# EAGLE design Frank-Synced-BLDC-ESC (EAGLE 6.2)
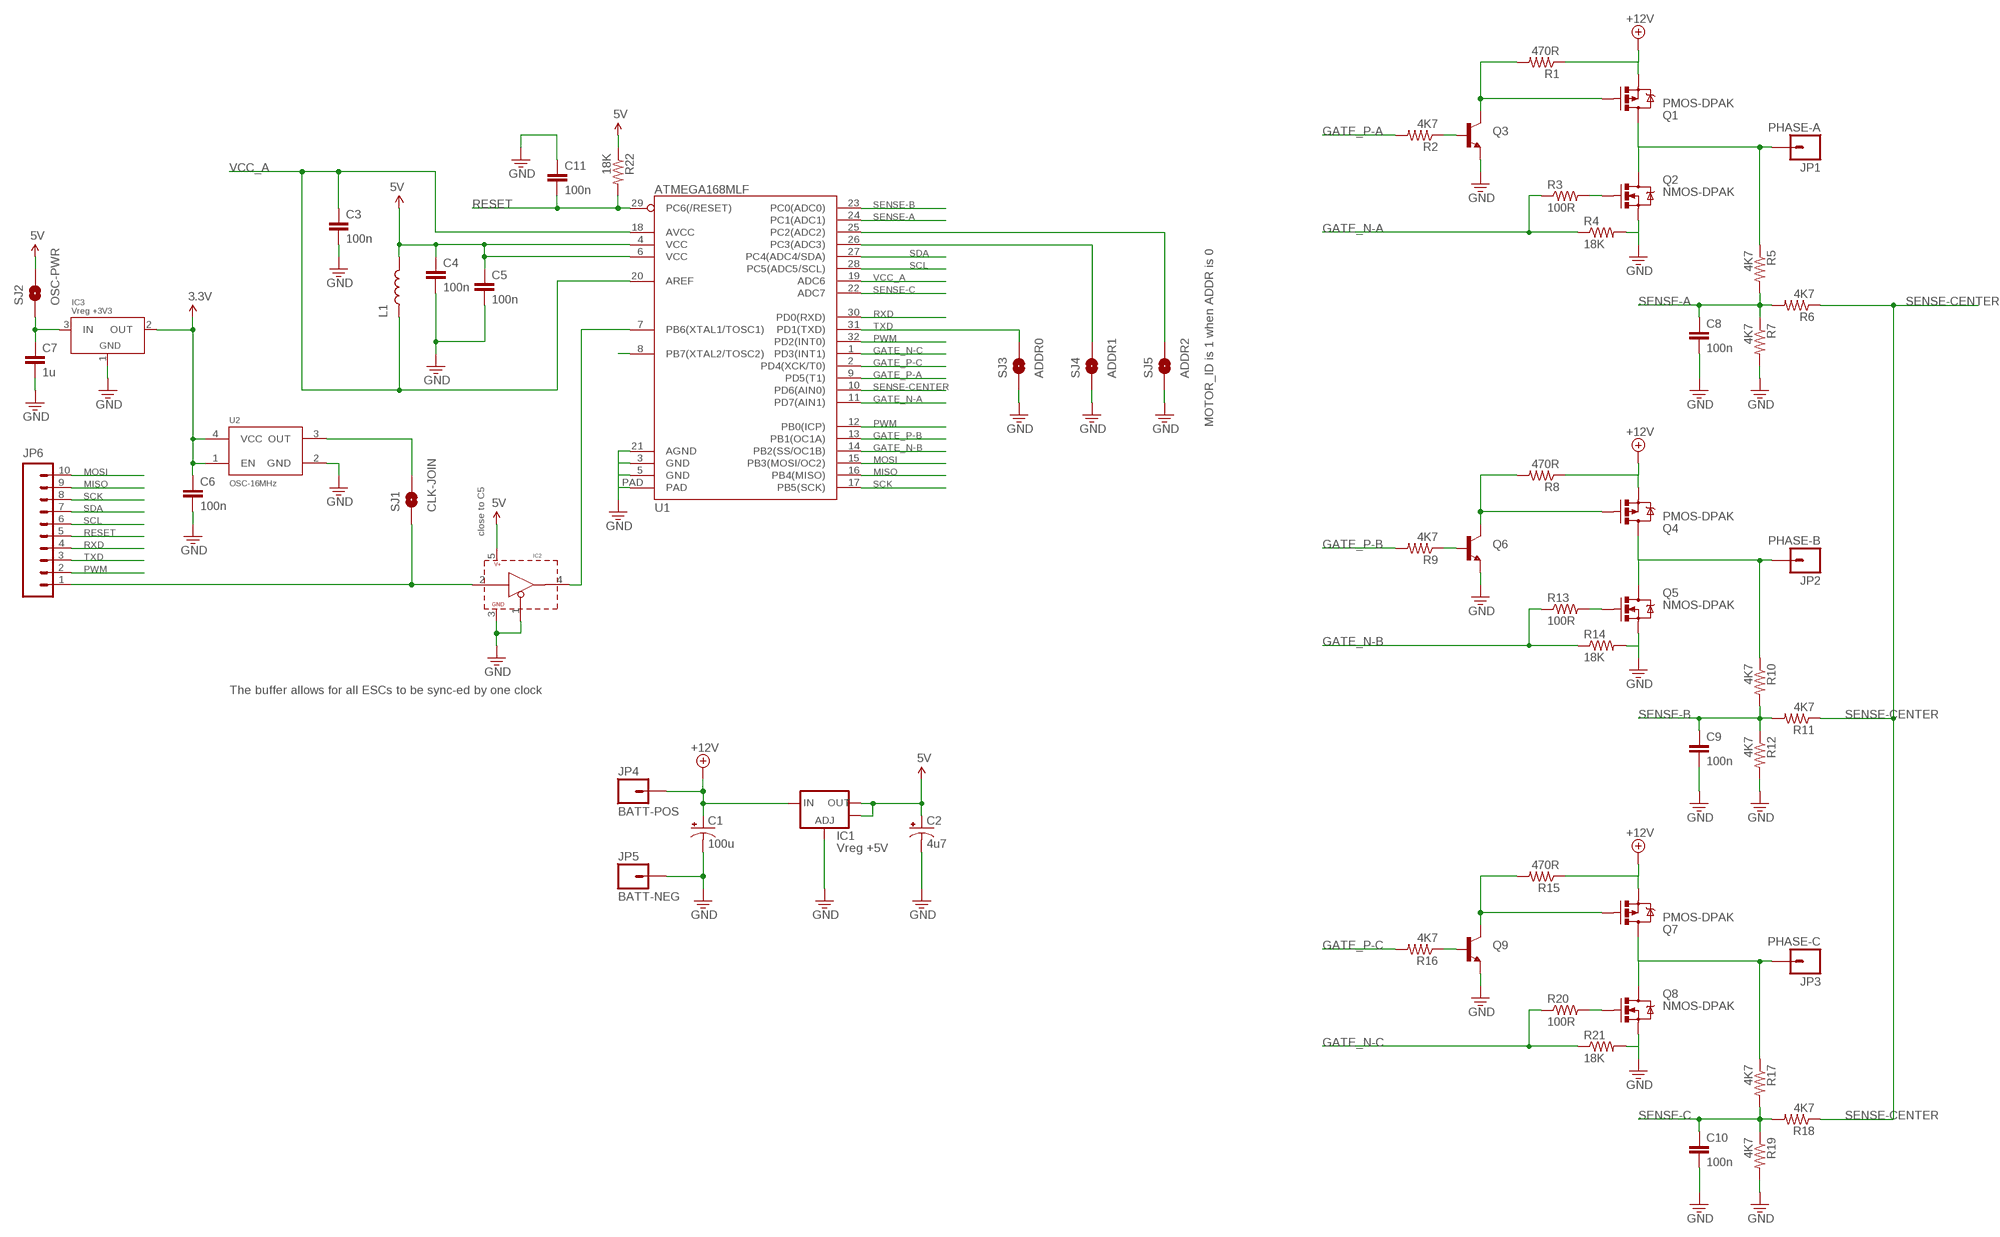
[diagram p0: schematic, sheet 1]

## Parts
C1  100u  CAP_POL-AXIAL-LARGE  [CAP-AXIAL-LARGE]
C2  4u7  CAP_POL1206-KIT  [EIA3216-KIT]
C3  100n  CAP0603-CAP  [0603-CAP]
C4  100n  CAP0603-CAP  [0603-CAP]
C5  100n  CAP0603-CAP  [0603-CAP]
C6  100n  CAP0603-CAP  [0603-CAP]
C7  1u  CAP0603-CAP  [0603-CAP]
C8  100n  CAP0603-CAP  [0603-CAP]
C9  100n  CAP0603-CAP  [0603-CAP]
C10  100n  CAP0603-CAP  [0603-CAP]
C11  100n  CAP0603-CAP  [0603-CAP]
IC1  Vreg +5V  V_REG_LM1117SOT223  [SOT223]
IC2  BUFFER-SINGLE-SOT-23-5  [SOT23-5]
IC3  Vreg +3V3  V_REG_LDO-SOT23-3  [SOT23-3]
JP1  PHASE-A  M01-MOTORPHASE  [1X1-MOTOR]
JP2  PHASE-B  M01-MOTORPHASE  [1X1-MOTOR]
JP3  PHASE-C  M01-MOTORPHASE  [1X1-MOTOR]
JP4  BATT-POS  M01-BATT  [1X1-BATT]
JP5  BATT-NEG  M01-BATT  [1X1-BATT]
JP6  M10"  [1X10]
L1  INDUCTOR0603  [0603]
Q1  PMOS-DPAK  MOSFET-PCHANNEL-DPAK  [DPAK]
Q2  NMOS-DPAK  MOSFET-NCHANNEL-DPAK  [DPAK]
Q3  TRANSISTOR_NPNSOT23-3  [SOT23-3]
Q4  PMOS-DPAK  MOSFET-PCHANNEL-DPAK  [DPAK]
Q5  NMOS-DPAK  MOSFET-NCHANNEL-DPAK  [DPAK]
Q6  TRANSISTOR_NPNSOT23-3  [SOT23-3]
Q7  PMOS-DPAK  MOSFET-PCHANNEL-DPAK  [DPAK]
Q8  NMOS-DPAK  MOSFET-NCHANNEL-DPAK  [DPAK]
Q9  TRANSISTOR_NPNSOT23-3  [SOT23-3]
R1  470R  RESISTOR0603-RES  [0603-RES]
R2  4K7  RESISTOR0603-RES  [0603-RES]
R3  100R  RESISTOR0603-RES  [0603-RES]
R4  18K  RESISTOR0603-RES  [0603-RES]
R5  4K7  RESISTOR0603-RES  [0603-RES]
R6  4K7  RESISTOR0603-RES  [0603-RES]
R7  4K7  RESISTOR0603-RES  [0603-RES]
R8  470R  RESISTOR0603-RES  [0603-RES]
R9  4K7  RESISTOR0603-RES  [0603-RES]
R10  4K7  RESISTOR0603-RES  [0603-RES]
R11  4K7  RESISTOR0603-RES  [0603-RES]
R12  4K7  RESISTOR0603-RES  [0603-RES]
R13  100R  RESISTOR0603-RES  [0603-RES]
R14  18K  RESISTOR0603-RES  [0603-RES]
R15  470R  RESISTOR0603-RES  [0603-RES]
R16  4K7  RESISTOR0603-RES  [0603-RES]
R17  4K7  RESISTOR0603-RES  [0603-RES]
R18  4K7  RESISTOR0603-RES  [0603-RES]
R19  4K7  RESISTOR0603-RES  [0603-RES]
R20  100R  RESISTOR0603-RES  [0603-RES]
R21  18K  RESISTOR0603-RES  [0603-RES]
R22  18K  RESISTOR0603-RES  [0603-RES]
SJ1  CLK-JOIN  SOLDERJUMPERNC  [SJ_2S]
SJ2  OSC-PWR  SOLDERJUMPERNC  [SJ_2S]
SJ3  ADDR0  SOLDERJUMPERNO  [SJ_2S-NO]
SJ4  ADDR1  SOLDERJUMPERNO  [SJ_2S-NO]
SJ5  ADDR2  SOLDERJUMPERNO  [SJ_2S-NO]
U1  ATMEGA168MLF  [MLF32]
U2  OSC-16MHz  OSCILLATOR-2.5X2  [OSCILLATOR-2.5X2]

## Nets
3.3V: C6.1 IC3.2(OUT) U2.1(EN) U2.4(VCC)
5V: C2.A(+) C4.1 C5.1 IC1.2(OUT) IC1.4(OUT) IC2.5(V+) L1.2 R22.1 SJ2.2 U1.4(VCC) U1.6(VCC)
+12V: C1.+ IC1.3(IN) JP4.P$1 Q1.3(S) Q4.3(S) Q7.3(S) R1.1 R8.1 R15.1
CLK: IC2.4(OUT) U1.7(PB6(XTAL1/TOSC1))
GATE_N-A: R3.1 R4.1 U1.11(PD7(AIN1))
GATE_N-B: R13.1 R14.1 U1.14(PB2(SS/OC1B))
GATE_N-C: R20.1 R21.1 U1.1(PD3(INT1))
GATE_P-A: R2.2 U1.9(PD5(T1))
GATE_P-B: R9.2 U1.13(PB1(OC1A))
GATE_P-C: R16.2 U1.2(PD4(XCK/T0))
GND: C1.- C2.C(-) C3.2 C4.2 C5.2 C6.2 C7.2 C8.2 C9.2 C10.2 C11.1 IC1.1(ADJ) IC2.1(!OE) IC2.3(GND) IC3.1(GND) JP5.P$1 Q2.3(S) Q3.2(E) Q5.3(S) Q6.2(E) Q8.3(S) Q9.2(E) R4.2 R7.2 R12.2 R14.2 R19.2 R21.2 SJ3.1 SJ4.1 SJ5.1 U1.3(GND) U1.5(GND) U1.21(AGND) U1.PAD U2.2(GND)
MISO: JP6.9 U1.16(PB4(MISO))
MOSI: JP6.10 U1.15(PB3(MOSI/OC2))
N$1: JP1.P$1 Q1.4(D) Q2.4(D) R5.1
N$2: Q3.1(B) R2.1
N$3: Q1.1(G) Q3.3(C) R1.2
N$4: SJ4.2 U1.26(PC3(ADC3))
N$5: SJ5.2 U1.25(PC2(ADC2))
N$6: U1.8(PB7(XTAL2/TOSC2))
N$7: Q2.1(G) R3.2
N$8: JP2.P$1 Q4.4(D) Q5.4(D) R10.1
N$9: C7.1 IC3.3(IN) SJ2.1
N$10: Q4.1(G) Q6.3(C) R8.2
N$11: Q6.1(B) R9.1
N$14: Q5.1(G) R13.2
N$16: JP3.P$1 Q7.4(D) Q8.4(D) R17.1
N$17: Q7.1(G) Q9.3(C) R15.2
N$18: Q9.1(B) R16.1
N$21: Q8.1(G) R20.2
N$23: IC2.2(IN) JP6.1 SJ1.1
N$24: SJ1.2 U2.3(OUT)
PWM: JP6.2 U1.12(PB0(ICP)) U1.32(PD2(INT0))
RESET: C11.2 JP6.5 R22.2 U1.29(PC6(/RESET))
RXD: JP6.4 U1.30(PD0(RXD))
SCK: JP6.8 U1.17(PB5(SCK))
SCL: JP6.6 U1.28(PC5(ADC5/SCL))
SDA: JP6.7 U1.27(PC4(ADC4/SDA))
SENSE-A: C8.1 R5.2 R6.2 R7.1 U1.24(PC1(ADC1))
SENSE-B: C9.1 R10.2 R11.2 R12.1 U1.23(PC0(ADC0))
SENSE-C: C10.1 R17.2 R18.2 R19.1 U1.22(ADC7)
SENSE-CENTER: R6.1 R11.1 R18.1 U1.10(PD6(AIN0))
TXD: JP6.3 SJ3.2 U1.31(PD1(TXD))
VCC_A: C3.1 L1.1 U1.18(AVCC) U1.19(ADC6) U1.20(AREF)

## Notes on the sheet
- MOTOR_ID is 1 when ADDR is 0
- close to C5
- The buffer allows for all ESCs to be sync-ed by one clock

## Library data of the parts
C1 C2 = Frank-Synced-BLDC-ESC:CAP_POL: Capacitor Polarized These are standard SMD and PTH capacitors. Normally 10uF, 47uF, and 100uF in electrolytic and tantalum varieties. Always verify the external diameter of the through hole cap, it varies with capacity, voltage, and manufacturer. The EIA devices should be standard.
C3-C11 = Frank-Synced-BLDC-ESC:CAP: Capacitor Standard 0603 ceramic capacitor, and 0.1" leaded capacitor.
IC1 = Frank-Synced-BLDC-ESC:V_REG_LM1117: Voltage Regulator LM1117 Standard adjustable voltage regulator but in SMD form. Spark Fun Electronics SKU : COM-00595
IC2 = Frank-Synced-BLDC-ESC:BUFFER-SINGLE
IC3 = Frank-Synced-BLDC-ESC:V_REG_LDO-SOT23-3
JP1-JP5 = Frank-Synced-BLDC-ESC:M01: Header 1 Standard 1-pin 0.1" header. Use with straight break away headers (SKU : PRT-00116), right angle break away headers (PRT-00553), swiss pins (PRT-00743), machine pins (PRT-00117), and female headers (PRT-00115).
JP6 = Frank-Synced-BLDC-ESC:M10: Header 10 Standard 10-pin 0.1" header. Use with straight break away headers (SKU : PRT-00116), right angle break away headers (PRT-00553), swiss pins (PRT-00743), machine pins (PRT-00117), and female headers (PRT-00115).
L1 = Frank-Synced-BLDC-ESC:INDUCTOR: Inductors Basic Inductor/Choke - 0603 and 1206. Footprints are not proven and vary greatly between part numbers.
Q1 Q4 Q7 = Frank-Synced-BLDC-ESC:MOSFET-PCHANNEL
Q2 Q5 Q8 = Frank-Synced-BLDC-ESC:MOSFET-NCHANNEL
Q3 Q6 Q9 = Frank-Synced-BLDC-ESC:TRANSISTOR_NPN: Transistor NPN BJT configuration in SOT23 package. MMBT2222 is the common NPN we use. Double check BCE configuration again layout.
R1-R22 = Frank-Synced-BLDC-ESC:RESISTOR: Resistor Basic schematic elements and footprints for 0603, 1206, and PTH resistors.
SJ1-SJ5 = Frank-Synced-BLDC-ESC:SOLDERJUMPER: Solder Jumper Standard SMD solder jumper. Used to automate production. Two varients : Normally Open and Normally Closed are the same, but have different paste layers. NC will have a large amount of paste and should jumper during reflow.
U1 = Frank-Synced-BLDC-ESC:ATMEGA168
U2 = Frank-Synced-BLDC-ESC:OSCILLATOR

## Board
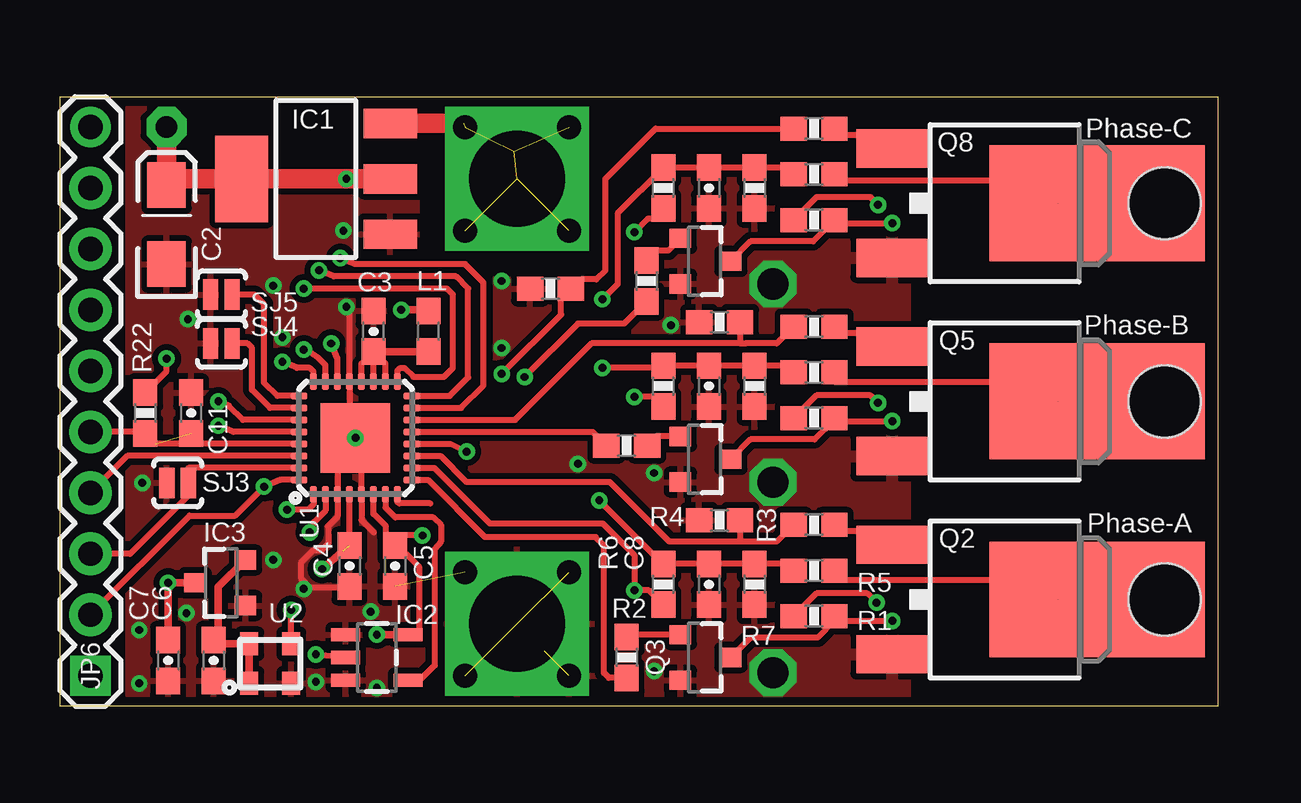
[diagram p1: board, top side]
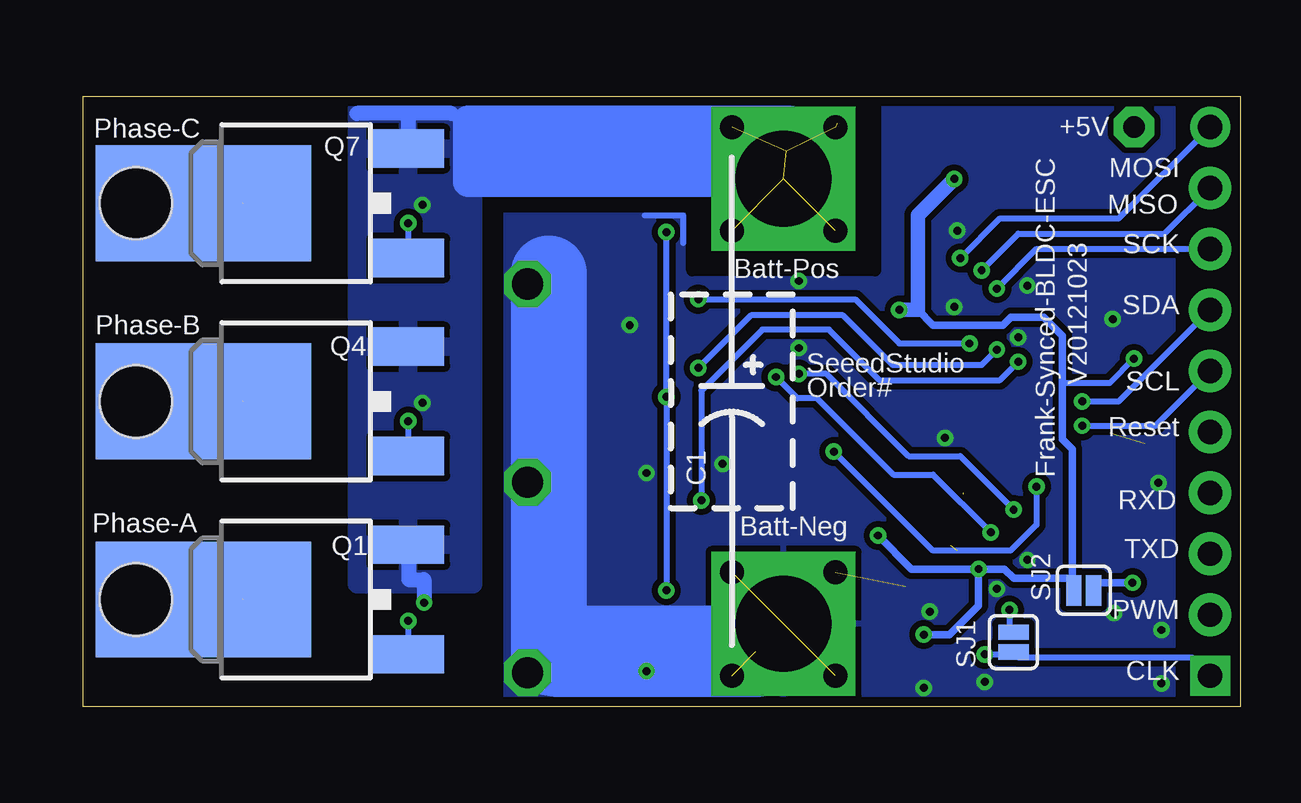
[diagram p2: board, bottom side, seen from below]

Size 48.26 x 25.4 mm. Coordinates in mm from the lower left corner, seen from the top.
Outline: 48.26,0 0,0 0,25.4 48.26,25.4 48.26,0
Copper layers (1*16): Top 0.0356mm / dielectric 1.5011mm / Bottom 0.0356mm
Design rules: minimum track width 6mil, minimum drill 13mil, track to track 6mil, track to pad 6mil, pad to pad 6mil, via to via 6mil, smd to smd 6mil, copper to edge 15mil, drill to drill 6mil, minimum pad ring 7mil, minimum via ring 7mil, stop-mask expansion 2mil, vias tented up to drill 25mil, thermal gap 10mil
tRestrict: area 15.2,18.2 to 22.9,25.4
bRestrict: area 15.2,18.2 to 22.9,25.4; 1 lines

### Footprints (pad centres in the part's own frame; a part is rotated, then mirrored left to right if it is on the bottom)
CAP-AXIAL-LARGE = drill 1 pad 1.676 octagon: + -11.43,0 | drill 1 pad 1.676: - 11.43,0
EIA3216-KIT = smd 1.9 x 1.6: A 1.65,0; C -1.65,0
0603-CAP = smd 1.1 x 1: 1 -0.85,0; 2 0.85,0
SOT223 = smd 1.219 x 2.235: 1 -2.311,-3.099; 2 0,-3.099; 3 2.311,-3.099 | smd 3.6 x 2.2: 4 0,3.099
SOT23-5 = smd 0.55 x 1.2: 1 -0.95,-1.3; 2 0,-1.3; 3 0.95,-1.3; 4 0.95,1.3; 5 -0.95,1.3
SOT23-3 = smd 0.8 x 0.9: 1 -0.95,-1; 2 0.95,-1; 3 0,1.1
1X1-MOTOR = smd 4.826 x 3.378: P$1 0,0 | smd 4.826 x 3.378 bottom: P$2 0,0 | hole 3: 0,0
1X1-BATT = drill 4 pad 6 square: P$1 0,0
1X10 = drill 1.016 pad 1.676 square: 1 0,0 | drill 1.016 pad 1.778: 2 2.54,0; 3 5.08,0; 4 7.62,0; 5 10.16,0; 6 12.7,0; 7 15.24,0; 8 17.78,0; 9 20.32,0 | drill 1.016 pad 1.676: 10 22.86,0
0603 = smd 1.1 x 1: 1 -0.85,0; 2 0.85,0
DPAK = smd 1.6 x 3: 1 -2.28,-5.31; 3 2.28,-5.31 | smd 4.826 x 5.715: 4 0,1.588
0603-RES = smd 1.1 x 1: 1 -0.85,0; 2 0.85,0
SJ_2S = smd 0.635 x 1.27: 1 -0.412,0; 2 0.412,0
SJ_2S-NO = smd 0.635 x 1.27: 1 -0.45,0; 2 0.45,0
MLF32 = smd 0.7 x 0.3: 1 -2.35,1.75; 2 -2.35,1.25; 3 -2.35,0.75; 4 -2.35,0.25; 5 -2.35,-0.25; 6 -2.35,-0.75; 7 -2.35,-1.25; 8 -2.35,-1.75; 17 2.35,-1.75; 18 2.35,-1.25; 19 2.35,-0.75; 20 2.35,-0.25; 21 2.35,0.25; 22 2.35,0.75; 23 2.35,1.25; 24 2.35,1.75 | smd 0.3 x 0.7: 9 -1.75,-2.35; 10 -1.25,-2.35; 11 -0.75,-2.35; 12 -0.25,-2.35; 13 0.25,-2.35; 14 0.75,-2.35; 15 1.25,-2.35; 16 1.75,-2.35; 25 1.75,2.35; 26 1.25,2.35; 27 0.75,2.35; 28 0.25,2.35; 29 -0.25,2.35; 30 -0.75,2.35; 31 -1.25,2.35; 32 -1.75,2.35 | smd 2.9 x 2.9: PAD 0,0
OSCILLATOR-2.5X2 = smd 0.75 x 0.95: 1 -0.875,-0.825; 2 0.875,-0.825; 3 0.875,0.825; 4 -0.875,0.825

### Placement (x,y rotation side)
C1  21.21,12.7 270 bottom
C2  4.45,20.07 90 top
C3  13.07,15.62 90 top
C4  12.07,5.84 270 top
C5  13.97,5.84 270 top
C6  6.41,1.91 270 top
C7  4.51,1.91 270 top
C8  27.05,5.08 270 top
C9  27.05,13.34 270 top
C10  27.05,21.59 270 top
C11  5.46,12.22 270 top
IC1  10.67,21.97 90 top
IC2  13.21,2.03 270 top
IC3  6.73,5.14 90 top
JP1  46.04,4.45 270 bottom
JP2  46.04,12.7 270 bottom
JP3  46.04,20.95 270 bottom
JP4  19.05,21.97 0 bottom
JP5  19.05,3.43 0 bottom
JP6  1.27,1.27 90 top
L1  15.37,15.62 90 top
Q1  40.01,4.45 90 bottom
Q2  40.01,4.45 270 top
Q3  26.86,2.03 270 top
Q4  40.01,12.7 90 bottom
Q5  40.01,12.7 270 top
Q6  26.86,10.29 270 top
Q7  40.01,20.95 90 bottom
Q8  40.01,20.95 270 top
Q9  26.86,18.54 270 top
R1  31.43,3.75 0 top
R2  23.62,2.03 270 top
R3  31.43,7.56 0 top
R4  27.5,7.75 180 top
R5  31.43,5.65 180 top
R6  25.15,5.08 90 top
R7  28.96,5.08 270 top
R8  31.43,12 0 top
R9  23.62,10.86 180 top
R10  31.43,13.91 180 top
R11  25.15,13.34 90 top
R12  28.96,13.34 270 top
R13  31.43,15.81 0 top
R14  27.5,16 180 top
R15  31.43,20.26 0 top
R16  24.45,17.72 270 top
R17  31.43,22.16 180 top
R18  25.15,21.59 90 top
R19  28.96,21.59 270 top
R20  31.43,24.07 0 top
R21  20.45,17.4 180 top
R22  3.56,12.22 270 top
SJ1  9.47,2.67 90 bottom
SJ2  6.54,4.83 180 bottom
SJ3  4.91,9.31 0 top
SJ4  6.73,15.11 0 top
SJ5  6.73,17.14 0 top
U1  12.32,11.18 90 top
U2  8.76,1.78 0 top

### Tracks (layer width: path | path; a pad name or v marks a point on that pad's centre or on a via)
3.3V
  Top 0.305: IC3.2 6.6,4.97 6.6,2.75 | 6.6,2.75 C6.1 | 6.6,2.75 6.6,2.6 U2.4 U2.1
5V  (via drill 0.33, 0.9 pad 1.68)  (1 unrouted)
  Top 0.254: C4.1 U1.4 | C5.1 13.59,7.07 13.59,7.49 13.07,8.01 U1.6 | IC2.5 14.99,2.98 14.99,5.78 14.42,6.35 13.97,6.35 C5.1 | 15.37,16.51 L1.2 | R22.1 4.45,13.96 v4.45,14.48 | IC1.4 7.57,23.62 | v15.11,7.11 13.97,7.11 C5.1 | 4.45,21.97 4.45,22.48
  Top 0.305: v14.22,16.51 15.37,16.51 | v13.21,2.98 IC2.5 | v10.92,5.71 11.81,6.48
  Top 0.813: IC1.2 v11.94,21.97 IC1.4 4.45,21.97 | v4.45,24.13 4.45,21.97 | C2.A 4.45,21.97
  Bottom 0.254: v4.45,14.48 5.46,13.46 7.43,13.46
  Bottom 0.305: SJ2.2 7.02,5.33 | 7.02,5.33 9.46,5.33 9.84,5.71 v10.92,5.71 | v13.21,2.98 12.13,2.98 10.92,4.19 v10.92,5.71 | 7.02,5.33 7.02,10.7 7.43,11.11 7.43,13.46 7.43,15.43 8.2,16.2 9.58,16.2 9.91,15.88 12.83,15.88 13.46,16.51 | v10.92,5.71 13.72,5.71 v15.11,7.11
  Bottom 0.61: v14.22,16.51 13.46,16.51 13.46,20.45 v11.94,21.97
+12V  (via drill 0.33, 1)  (6 unrouted)
  Top 0.254: v34.04,4.32 33.66,4.7 31.54,4.7 R1.1 | v34.1,12.64 33.78,12.95 31.54,12.95 R8.1 | v34.1,20.89 33.78,21.21 31.54,21.21 R15.1
  Top 0.813: IC1.3 16.83,24.28
  Bottom 0.635: 34.7,24.7 36.83,24.7 | 32.89,24.7 34.7,24.7 | 34.7,24.7 Q7.3 | Q1.3 34.67,6.72 34.67,5.27 34.04,5.27 v34.04,4.32
  Bottom 1.27: 30.73,23.11 30.73,21.84 32.19,21.84 32.19,24.38 30.29,24.38
  Bottom 3.81: 18.92,23.11 30.73,23.11
  other vias: 16.89,19.81 21.21,19.81 16.89,24.13
  pour Bottom (isolate 0.254): 36.83,25.4 32,25.46 32,5.08 36.83,5.08
CLK
  Top 0.254: U1.7 13.57,8.28 13.97,7.87 15.56,7.87 15.88,7.55 15.88,6.86 15.62,6.54 15.62,1.71 15,1.08 IC2.4
GATE_N-A
  Top 0.254: R3.1 29.88,6.86 28.35,6.86 | 28.35,6.86 25.4,6.86 22.92,9.34 16.95,9.34 15.86,10.43 U1.11 | R4.1 28.35,6.86
GATE_N-B
  Top 0.254: R13.1 29.88,15.11 28.57,15.11 28.35,15.11 | U1.14 18.97,11.93 22.16,15.11 28.35,15.11 | R14.1 28.35,15.11
GATE_N-C  (via drill 0.33)
  Top 0.254: U1.1 10.57,8.41 10.35,8.19 v9.46,8.19 | R20.1 24.83,24.07 22.73,21.97 22.73,18.16 22.35,17.78 21.72,17.78 21.34,17.4 R21.1 20.89,17.4 20.89,16.32 v18.41,13.84
  Bottom 0.254: v9.46,8.19 11.68,10.41 13.84,10.41 17.27,13.84 v18.41,13.84
GATE_P-A
  Top 0.254: U1.9 15.34,9.43 17.72,7.05 22.33,7.05 22.67,6.71 22.67,1.39 22.88,1.18 R2.2
GATE_P-B
  Top 0.254: U1.13 22.2,11.43 R9.2
GATE_P-C  (via drill 0.33)
  Top 0.254: U1.2 11.07,8.15 10.59,7.67 v10.41,7.24 | v19.37,13.72 21.59,15.94 23.52,15.94 R16.2
  Bottom 0.254: v10.41,7.24 12.83,9.65 14.48,9.65 17.65,12.83 18.48,12.83 v19.37,13.72
GND  (via drill 0.33, 1, 1.3)  (5 unrouted)
  Top 0.254: 13.08,7.24 12.57,7.75 U1.5 12.57,10.93 U1.PAD 12.07,11.43 U1.21 12.07,16.76 | U1.3 11.57,7.89 11.18,7.49 11.18,6.76 10.89,6.48 10.54,6.48 10.03,5.97 10.03,5.33 10.41,4.95 12.06,4.95 | 11.57,9.84 11.57,8.9
  Bottom 0.254: 24.83,20.45 23.24,20.45 23.24,19.3
  Bottom 3.175: 28.83,2.03 28.83,18.03
  Bottom 3.81: 20.19,2.29 28.45,2.29
  other vias: 16.89,5.59 13.21,0.76 16.89,1.27 12.95,3.94 11.94,16.64 21.21,5.59 5.33,16.13 11.81,19.81 9.27,15.37 8.89,17.53 12.32,11.18 24.77,9.72 29.72,1.4 24.77,1.46 29.72,9.33 29.72,17.59 18.41,17.72 18.41,14.92 25.46,15.88 21.59,10.1 10.16,4.89 8.89,6.1 10.67,1.02 3.3,0.95 5.27,3.87 3.3,3.17 3.43,9.31
  pour Bottom (isolate 0.254): 30.48,0 30.48,25.4 23.81,25.4 23.81,0
  pour Top (isolate 0.254): 35.24,0 35.24,25.4 31.43,25.4 31.43,0
  pour Bottom (isolate 0.254): 23.81,0 23.81,25.4 2.86,25.4 2.86,0
  pour Top (isolate 0.254): 2.86,0 2.86,25.4 31.43,25.4 31.43,0
MISO  (via drill 0.33)
  Top 0.254: v10.79,18.16 11.41,17.91 16.51,17.91 17.02,17.4 17.02,13.7 16.24,12.93 U1.16
  Bottom 0.254: v10.79,18.16 9.27,19.68 3.17,19.68 JP6.9
MOSI  (via drill 0.33)
  Top 0.254: U1.15 16.72,12.43 17.65,13.36 17.65,17.65 16.89,18.41 12.3,18.41 v11.68,18.67
  Bottom 0.254: v11.68,18.67 10.03,20.32 5.08,20.32 JP6.10
N$1  (1 unrouted)
  Top 0.254: 32.28,5.52 R5.1 32.66,5.27 41.59,5.27 Q1.4 41.59,5.52
  Top 3.175: Q1.4 JP1.P$1
  Bottom 3.175: Q1.4 JP1.P$1
N$2
  Top 0.254: Q3.1 23.72,2.98 R2.1
N$3  (via drill 0.33)
  Top 0.254: R1.2 32.28,3.56 | 32.28,3.56 v34.7,3.56 | 32.28,3.56 31.58,2.86 28.79,2.86 Q3.3
  Bottom 0.254: v34.7,3.56 Q1.1
N$4
  Top 0.254: U1.26 8.75,12.43 8,13.18 8,14.93 7.82,15.11 SJ4.2
N$5
  Top 0.254: U1.25 9.07,12.93 8.51,13.48 8.51,16.74 8.11,17.14 SJ5.2
N$6
  Top 0.254: 15.43,8.45 14.14,8.45 14.07,8.51 U1.8
N$7
  Top 0.254: R3.2 32.54,7.3 34.7,7.3 Q2.1
N$8  (1 unrouted)
  Top 0.254: R10.1 32.28,13.53 41.59,13.53 Q4.4
  Top 3.175: Q4.4 JP2.P$1
  Bottom 3.175: Q4.4 JP2.P$1
N$9  (via drill 0.33)
  Top 0.305: C7.1 v4.51,5.14 IC3.3
  Bottom 0.305: SJ2.1 6.13,5.14 v4.51,5.14
N$10  (via drill 0.33)
  Top 0.254: R8.2 32.22,11.87 | 32.22,11.87 v34.7,11.87 | 32.22,11.87 31.46,11.11 28.79,11.11 Q6.3
  Bottom 0.254: v34.7,11.87 Q4.1
N$11
  Top 0.254: Q6.1 24.85,11.24 R9.1
N$14
  Top 0.254: R13.2 32.54,15.56 34.7,15.56 Q5.1
N$16  (1 unrouted)
  Top 0.254: R17.1 32.54,21.91 41.59,21.91 Q7.4 | Q7.4
  Top 3.175: Q7.4 JP3.P$1
  Bottom 3.175: Q7.4 JP3.P$1
N$17  (via drill 0.33)
  Top 0.254: v34.7,20.13 32.41,20.13 R15.2 31.39,19.37 28.79,19.37 Q9.3
  Bottom 0.254: v34.7,20.13 Q7.1
N$18
  Top 0.254: Q9.1 25.36,18.99 24.83,18.99 24.45,18.61 R16.1
N$21
  Top 0.254: 34.03,23.23 Q8.1 34.3,23.23 33.72,23.81 32.54,23.81 R20.2
N$23  (via drill 0.33)
  Top 0.254: v10.67,2.16 IC2.2
  Bottom 0.254: v10.67,2.16 9.47,2.16 SJ1.1 9.25,2.03 2.03,2.03 JP6.1
N$24  (via drill 0.33)
  Top 0.254: U2.3 v9.64,4.01
  Bottom 0.254: v9.64,4.01 9.64,3.25 SJ1.2
PWM  (via drill 0.33)
  Top 0.254: U1.12 16.28,10.93 v16.95,10.61 | U1.32 9.19,9.43 v8.51,9.14 7.3,7.94 5.4,7.94 JP6.2
  Bottom 0.254: v16.95,10.61 12.82,6.48 9.59,6.48 8.51,7.56 v8.51,9.14
RESET  (1 unrouted)
  Top 0.254: U1.29 4,10.93 R22.2 3.49,11.43 JP6.5
RXD
  Top 0.254: U1.30 2.81,10.43 JP6.4
SCK  (via drill 0.33)
  Top 0.254: v10.16,17.4 16.13,17.4 16.38,17.14 16.38,14.1 16,13.72 14.73,13.72 14.35,14.1 14.19,14.1 14.07,13.98 U1.17
  Bottom 0.254: v10.16,17.4 8.51,19.05 JP6.8
SCL  (via drill 0.33)
  Top 0.254: U1.28 7.23,11.43 v6.6,11.68
  Bottom 0.254: v6.6,11.68 3.56,11.68 JP6.6
SDA  (via drill 0.33)
  Top 0.254: U1.27 7.63,11.93 7.04,12.52 v6.6,12.7
  Bottom 0.254: v6.6,12.7 5.08,12.7 JP6.7
SENSE-A  (via drill 0.33)
  Top 0.254: U1.24 10.57,13.94 10.41,14.1 9.88,14.1 v9.27,14.35 | R5.2 30.3,5.93 R7.1 C8.1 R6.2 25.08,5.97 v22.48,8.57
  Bottom 0.254: v9.27,14.35 10.03,13.59 15.06,13.59 17.16,15.69 19.94,15.69 22.48,13.14 v22.48,8.57
SENSE-B  (via drill 0.33)
  Top 0.254: U1.23 11.07,14.21 10.76,14.52 10.41,14.76 v10.16,14.86 | R10.2 30.3,14.19 R12.1 C9.1 R11.2 25.06,14.1 v22.61,14.1
  Bottom 0.254: v22.61,14.1 20.41,16.29 16.57,16.29 14.51,14.22 10.79,14.22 v10.16,14.86
SENSE-C  (via drill 0.33)
  Top 0.254: U1.22 11.57,14.47 v11.3,15.11 | v22.61,16.95 23.24,17.59 23.24,19.88 23.24,20.54 R18.2 C10.1 R19.1 30.58,22.44 R17.2
  Bottom 0.254: v11.3,15.11 14.22,15.11 16.07,16.95 v22.61,16.95
SENSE-CENTER  (via drill 0.33)
  Top 0.254: U1.10 15.6,9.93 17.91,7.62 22.62,7.62 23.94,6.3 v23.94,4.83 24.55,4.83 R6.1 | R11.1 25.11,12.89 v23.94,12.89 | v23.94,19.75 24.51,20.32 25.15,20.32 R18.1
  Bottom 0.254: v23.94,4.83 v23.94,12.89 v23.94,19.75
TXD
  Top 0.254: U1.31 5.36,9.93 SJ3.2 5.36,8.79 2.92,6.35 JP6.3
VCC_A
  Top 0.254: U1.20 12.57,14.27 C3.1 | U1.18 13.57,14.27 C3.1 | U1.19 C3.1
  Top 0.305: L1.1 C3.1

### Text on the board
tNames: Phase-C | Phase-B | Phase-A
bNames: +5V | Phase-C | MOSI | MISO | SCK | Batt-Pos | SDA | Phase-B | SCL | Reset | RXD | TXD | Batt-Neg | Phase-A | PWM | CLK
_bsilk: SeeedStudio | V20121023 | Order# | Frank-Synced-BLDC-ESC